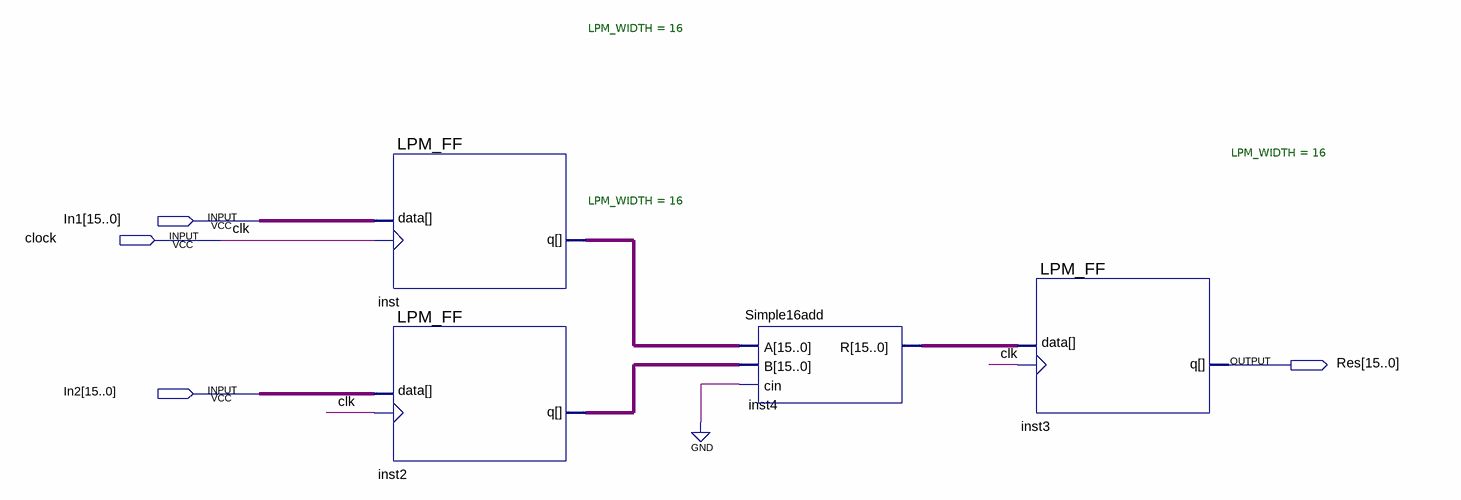
[diagram p0: schematic sheet]
// Quartus schematic test_Adder2.bdf as structural Verilog: 4 symbols, 4 pins
module test_Adder2 (
  input  [15:0] In1,
  input  clock,
  input  [15:0] In2,
  output [15:0] Res
);

  wire [15:0] inst2_q, inst4_r, inst_q;

  LPM_FF #(.LPM_WIDTH(16)) inst (.clock(clock), .data(In1), .q(inst_q));
  LPM_FF #(.LPM_WIDTH(16)) inst2 (.clock(clock), .data(In2), .q(inst2_q));
  Simple16add inst4 (.A(inst_q), .B(inst2_q), .cin(1'b0), .R(inst4_r));
  LPM_FF #(.LPM_WIDTH(16)) inst3 (.clock(clock), .data(inst4_r), .q(Res));

  // Other names for the same wires on the sheet: clk = clock
endmodule
